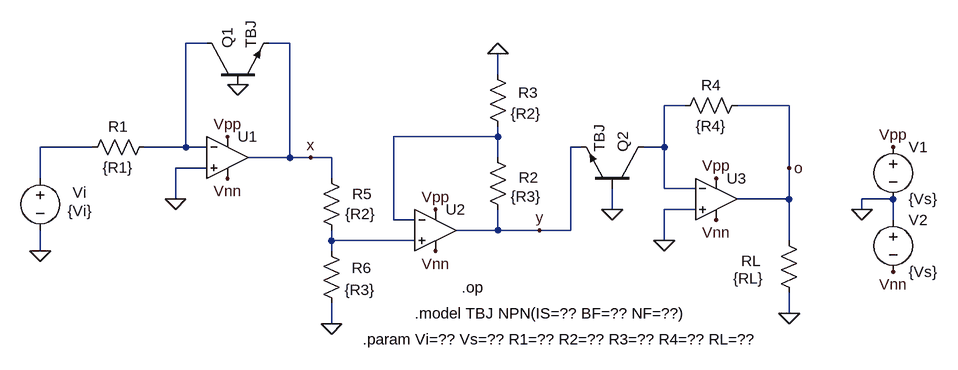
[diagram p0: schematic OPAMPTBJ05Fig.asc]
OPAMPTBJ05Fig.asc, the LTspice schematic file:
Version 4
SHEET 1 1608 1076
WIRE -128 192 -160 192
WIRE 0 192 -32 192
WIRE 320 240 320 208
WIRE 608 288 576 288
WIRE 768 288 688 288
WIRE 320 336 320 320
WIRE 320 336 160 336
WIRE -304 352 -384 352
WIRE -160 352 -160 192
WIRE -160 352 -224 352
WIRE -128 352 -160 352
WIRE 448 352 432 352
WIRE 576 352 576 288
WIRE 576 352 544 352
WIRE 0 368 0 192
WIRE 0 368 -64 368
WIRE 32 368 0 368
WIRE 64 368 32 368
WIRE 320 368 320 336
WIRE -128 384 -176 384
WIRE 768 384 768 288
WIRE -384 400 -384 352
WIRE 64 400 64 368
WIRE 576 416 576 352
WIRE 624 416 576 416
WIRE -176 432 -176 384
WIRE 768 432 768 384
WIRE 768 432 688 432
WIRE 928 432 880 432
WIRE 496 448 496 416
WIRE 624 448 576 448
WIRE 880 448 880 432
WIRE 160 464 160 336
WIRE 192 464 160 464
WIRE 928 464 928 432
WIRE 320 480 320 448
WIRE 320 480 256 480
WIRE 384 480 320 480
WIRE 432 480 432 352
WIRE 432 480 384 480
WIRE 64 496 64 480
WIRE 192 496 64 496
WIRE 576 496 576 448
WIRE 768 496 768 432
WIRE -384 512 -384 480
WIRE 64 512 64 496
WIRE 768 608 768 576
WIRE 64 624 64 592
FLAG 928 352 Vpp
FLAG 880 448 0
FLAG 928 544 Vnn
FLAG 768 608 0
FLAG -384 512 0
FLAG -96 336 Vpp
FLAG -96 400 Vnn
FLAG -176 432 0
FLAG -80 256 0
FLAG 656 400 Vpp
FLAG 656 464 Vnn
FLAG 576 496 0
FLAG 496 448 0
FLAG 768 384 o
FLAG 32 368 x
FLAG 224 448 Vpp
FLAG 224 512 Vnn
FLAG 320 208 0
FLAG 384 480 y
FLAG 64 624 0
SYMBOL npn -128 256 R270
SYMATTR InstName Q1
SYMATTR Value TBJ
SYMBOL voltage 928 336 R0
WINDOW 123 0 0 Left 0
WINDOW 39 0 0 Left 0
SYMATTR InstName V1
SYMATTR Value {Vs}
SYMBOL voltage 928 448 R0
WINDOW 123 0 0 Left 0
WINDOW 39 0 0 Left 0
SYMATTR InstName V2
SYMATTR Value {Vs}
SYMBOL res 752 480 R0
WINDOW 3 -70 74 Left 2
WINDOW 0 -58 47 Left 2
SYMATTR Value {RL}
SYMATTR InstName RL
SYMBOL voltage -384 384 R0
WINDOW 3 42 66 Left 2
WINDOW 123 0 0 Left 0
WINDOW 39 0 0 Left 0
WINDOW 0 50 38 Left 2
SYMATTR Value {Vi}
SYMATTR InstName Vi
SYMBOL Opamps\\UniversalOpamp2 -96 368 R0
SYMATTR InstName U1
SYMBOL res -320 368 R270
WINDOW 0 32 56 VTop 2
WINDOW 3 0 56 VBottom 2
SYMATTR InstName R1
SYMATTR Value {R1}
SYMBOL npn 544 416 M270
SYMATTR InstName Q2
SYMATTR Value TBJ
SYMBOL Opamps\\UniversalOpamp2 656 432 R0
SYMATTR InstName U3
SYMBOL res 592 304 R270
WINDOW 0 32 56 VTop 2
WINDOW 3 0 56 VBottom 2
SYMATTR InstName R4
SYMATTR Value {R4}
SYMBOL Opamps\\UniversalOpamp2 224 480 R0
SYMATTR InstName U2
SYMBOL res 304 352 R0
WINDOW 0 48 47 Left 2
SYMATTR InstName R2
SYMATTR Value {R3}
SYMBOL res 304 224 R0
WINDOW 0 47 44 Left 2
SYMATTR InstName R3
SYMATTR Value {R2}
SYMBOL res 48 384 R0
WINDOW 0 48 40 Left 2
WINDOW 3 37 71 Left 2
SYMATTR InstName R5
SYMATTR Value {R2}
SYMBOL res 48 496 R0
WINDOW 0 47 42 Left 2
SYMATTR InstName R6
SYMATTR Value {R3}
TEXT 112 648 Left 2 !.param Vi=?? Vs=?? R1=?? R2=?? R3=?? R4=?? RL=??
TEXT 264 568 Left 2 !.op
TEXT 192 608 Left 2 !.model TBJ NPN(IS=?? BF=?? NF=??)

The netlist it stands for:
* OPAMPTBJ05Fig.asc
Q1 N001 0 x 0 TBJ
V1 Vpp 0 {Vs}
V2 0 Vnn {Vs}
RL o 0 {RL}
Vi N004 0 {Vi}
XU1 0 N001 Vpp Vnn x level.2 Avol=1Meg GBW=10Meg Slew=10Meg ilimit=25m rail=0 Vos=0 phimargin=45 en=0 enk=0 in=0 ink=0 Rin=500Meg  ; pins IN+ IN- V+ V- OUT
R1 N004 N001 {R1}
Q2 N002 0 y 0 TBJ
XU3 0 N002 Vpp Vnn o level.2 Avol=1Meg GBW=10Meg Slew=10Meg ilimit=25m rail=0 Vos=0 phimargin=45 en=0 enk=0 in=0 ink=0 Rin=500Meg  ; pins IN+ IN- V+ V- OUT
R4 N002 o {R4}
XU2 N005 N003 Vpp Vnn y level.2 Avol=1Meg GBW=10Meg Slew=10Meg ilimit=25m rail=0 Vos=0 phimargin=45 en=0 enk=0 in=0 ink=0 Rin=500Meg  ; pins IN+ IN- V+ V- OUT
R2 N003 y {R3}
R3 0 N003 {R2}
R5 x N005 {R2}
R6 N005 0 {R3}
.model NPN NPN
.model PNP PNP
.lib standard.bjt
.param Vi=?? Vs=?? R1=?? R2=?? R3=?? R4=?? RL=??
.op
.model TBJ NPN(IS=?? BF=?? NF=??)
.lib UniversalOpamps2.sub
.backanno
.end